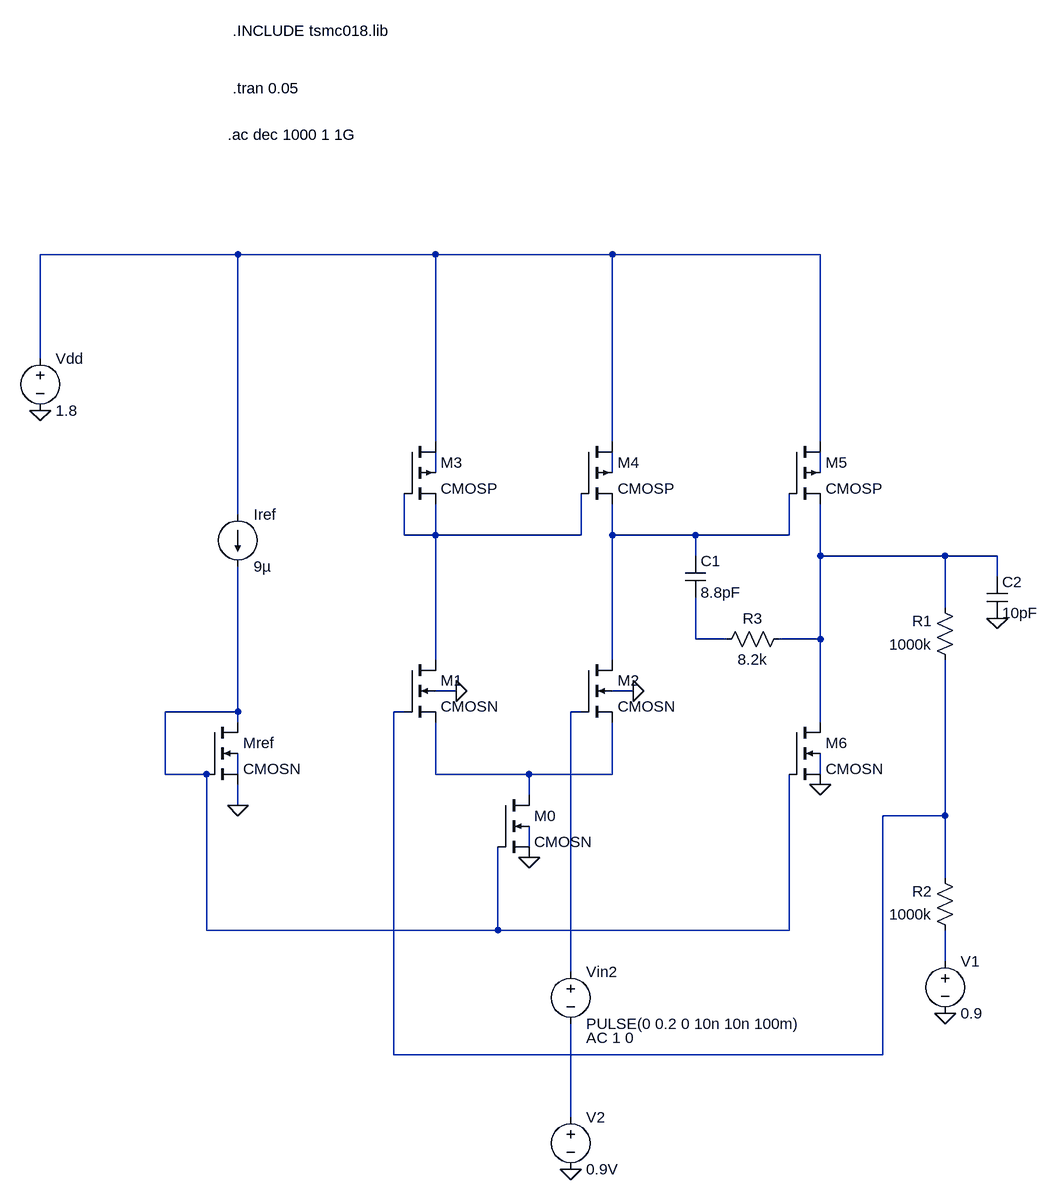
[diagram p0: schematic 230102116_harshKumar_asc.asc]
230102116_harshKumar_asc.asc, the LTspice schematic file:
Version 4
SHEET 1 1588 896
WIRE 96 -528 -208 -528
WIRE 400 -528 96 -528
WIRE 672 -528 400 -528
WIRE 992 -528 672 -528
WIRE -208 -368 -208 -528
WIRE 400 -240 400 -528
WIRE 672 -240 672 -528
WIRE 992 -240 992 -528
WIRE 400 -192 400 -224
WIRE 672 -192 672 -224
WIRE 992 -192 992 -224
WIRE 96 -128 96 -528
WIRE 352 -96 352 -160
WIRE 400 -96 400 -144
WIRE 400 -96 352 -96
WIRE 624 -96 624 -160
WIRE 624 -96 400 -96
WIRE 672 -96 672 -144
WIRE 800 -96 672 -96
WIRE 944 -96 944 -160
WIRE 944 -96 800 -96
WIRE 800 -64 800 -96
WIRE 992 -64 992 -144
WIRE 1184 -64 992 -64
WIRE 1264 -64 1184 -64
WIRE 1264 -32 1264 -64
WIRE 1184 16 1184 -64
WIRE 800 64 800 0
WIRE 848 64 800 64
WIRE 992 64 992 -64
WIRE 992 64 928 64
WIRE 400 96 400 -96
WIRE 672 96 672 -96
WIRE 432 144 400 144
WIRE 704 144 672 144
WIRE 96 176 96 -48
WIRE 96 176 -16 176
WIRE 352 176 336 176
WIRE 624 176 608 176
WIRE 96 192 96 176
WIRE 992 192 992 64
WIRE -16 272 -16 176
WIRE 48 272 -16 272
WIRE 96 272 96 240
WIRE 400 272 400 192
WIRE 544 272 400 272
WIRE 672 272 672 192
WIRE 672 272 544 272
WIRE 992 272 992 240
WIRE 544 304 544 272
WIRE 96 320 96 288
WIRE 1184 336 1184 96
WIRE 1184 336 1088 336
WIRE 544 384 544 352
WIRE 1184 432 1184 336
WIRE 48 512 48 272
WIRE 496 512 496 384
WIRE 496 512 48 512
WIRE 944 512 944 272
WIRE 944 512 496 512
WIRE 1184 560 1184 512
WIRE 608 576 608 176
WIRE 336 704 336 176
WIRE 1088 704 1088 336
WIRE 1088 704 336 704
WIRE 608 800 608 656
FLAG 544 400 0
FLAG 432 144 0
FLAG 704 144 0
FLAG 992 288 0
FLAG 96 320 0
FLAG -208 -288 0
FLAG 1184 640 0
FLAG 1264 32 0
FLAG 608 880 0
SYMBOL current 96 -128 R0
SYMATTR InstName Iref
SYMATTR Value 9µ
SYMBOL cmosn 352 96 R0
SYMATTR InstName M1
SYMATTR Value2 l=1u w=15u
SYMBOL cmosn 624 96 R0
SYMATTR InstName M2
SYMATTR Value2 l=1u w=15u
SYMBOL cmosn 496 304 R0
SYMATTR InstName M0
SYMATTR Value2 l=1u w=23u
SYMBOL cmosn 48 192 R0
SYMATTR InstName Mref
SYMATTR Value2 l=1u w=2.02u
SYMBOL cmosn 944 192 R0
SYMATTR InstName M6
SYMATTR Value2 l=1u w=23u
SYMBOL cmosp 352 -240 R0
SYMATTR InstName M3
SYMATTR Value2 l=1u w=22.5u
SYMBOL cmosp 624 -240 R0
SYMATTR InstName M4
SYMATTR Value2 l=1u w=22.5u
SYMBOL cmosp 944 -240 R0
SYMATTR InstName M5
SYMATTR Value2 l=1u w=45u
SYMBOL voltage 608 560 R0
WINDOW 123 24 118 Left 2
SYMATTR InstName Vin2
SYMATTR Value PULSE(0 0.2 0 10n 10n 100m)
SYMATTR Value2 AC 1 0
SYMBOL voltage -208 -384 R0
SYMATTR InstName Vdd
SYMATTR Value 1.8
SYMBOL Res 1200 112 R180
WINDOW 0 36 76 Left 2
WINDOW 3 36 40 Left 2
SYMATTR InstName R1
SYMATTR Value 1000k
SYMBOL Res 1200 528 R180
WINDOW 0 36 76 Left 2
WINDOW 3 36 40 Left 2
SYMATTR InstName R2
SYMATTR Value 1000k
SYMBOL voltage 1184 544 R0
SYMATTR InstName V1
SYMATTR Value 0.9
SYMBOL cap 784 -64 R0
SYMATTR InstName C1
SYMATTR Value 8.8pF
SYMBOL Res 944 48 R90
WINDOW 0 0 56 VBottom 2
WINDOW 3 32 56 VTop 2
SYMATTR InstName R3
SYMATTR Value 8.2k
SYMBOL cap 1248 -32 R0
SYMATTR InstName C2
SYMATTR Value 10pF
SYMBOL voltage 608 784 R0
SYMATTR InstName V2
SYMATTR Value 0.9V
TEXT 88 -872 Left 2 !.INCLUDE tsmc018.lib
TEXT 88 -784 Left 2 !.tran 0.05
TEXT 80 -712 Left 2 !.ac dec 1000 1 1G

The netlist it stands for:
* 230102116_harshKumar_asc.asc
Iref N001 N009 9µ
M1 N005 N010 N013 0 CMOSN l=1u w=15u
M2 N006 N011 N013 0 CMOSN l=1u w=15u
M0 N013 N009 0 N015 CMOSN l=1u w=23u
Mref N009 N009 0 N012 CMOSN l=1u w=2.02u
M6 N007 N009 0 N014 CMOSN l=1u w=23u
M3 N001 N005 N005 N002 CMOSP l=1u w=22.5u
M4 N001 N005 N006 N003 CMOSP l=1u w=22.5u
M5 N001 N006 N007 N004 CMOSP l=1u w=45u
Vin2 N011 N017 PULSE(0 0.2 0 10n 10n 100m) AC 1 0
Vdd N001 0 1.8
R1 N010 N007 1000k
R2 N016 N010 1000k
V1 N016 0 0.9
C1 N006 N008 8.8pF
R3 N007 N008 8.2k
C2 N007 0 10pF
V2 N017 0 0.9V
.model NMOS NMOS
.model PMOS PMOS
.lib standard.mos
.INCLUDE tsmc018.lib
.tran 0.05
.ac dec 1000 1 1G
.backanno
.end